# Altium project LC_MATCH_1.PrjPcb
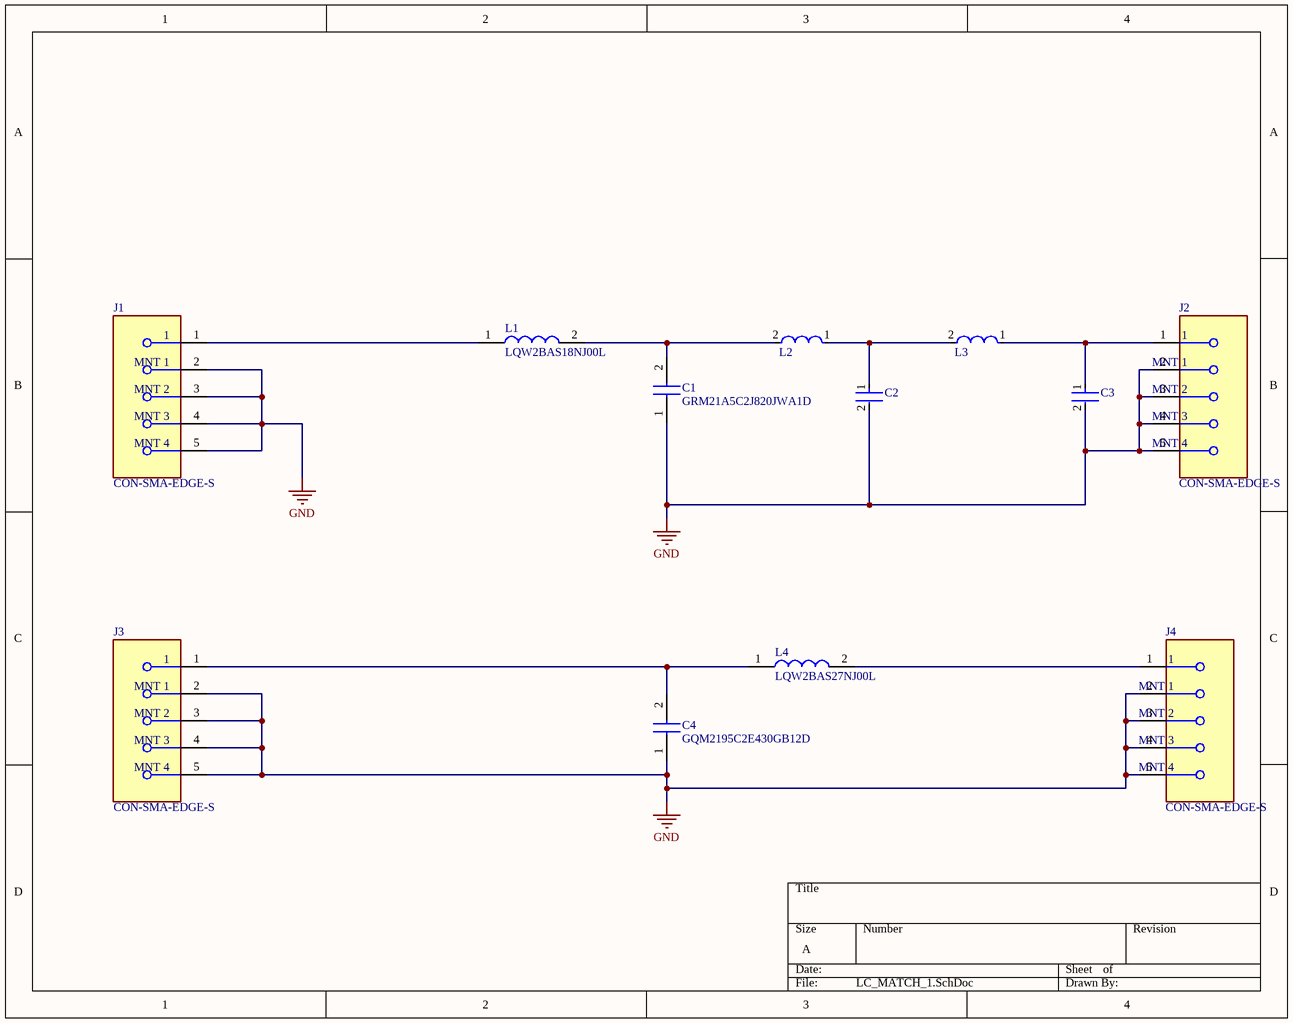
[diagram p0: LC_MATCH_1.SchDoc]
1 sheet, 12 parts. Net scope: global (net labels, ports and power ports of the same name join across sheets).
Board file: LC_MATCH_1.PcbDoc

## Sheet LC_MATCH_1.SchDoc
size A

### Parts
C1  GRM21A5C2J820JWA1D  [GRM21x]
C2  GQM2195C2E430GB12D  [FP-GRM21A-0_2-MFG]  (value not drawn)
C3  GQM2195C2E300GB12D  [FP-GRM21A-0_2-MFG]  (value not drawn)
C4  GQM2195C2E430GB12D  [GQM2195C2E100GB12D]
J1  CON-SMA-EDGE-S  [FP-CON-SMA-EDGE-S-MFG]
J2  CON-SMA-EDGE-S  [FP-CON-SMA-EDGE-S-MFG]
J3  CON-SMA-EDGE-S  [FP-CON-SMA-EDGE-S-MFG]
J4  CON-SMA-EDGE-S  [FP-CON-SMA-EDGE-S-MFG]
L1  LQW2BAS18NJ00L  [LQW2BAN11NG00L]
L2  LQW2BAS56NG00L  [FP-LQW2BAN_00-MFG]  (value not drawn)
L3  LQW2BAS56NG00L  [FP-LQW2BAN_00-MFG]  (value not drawn)
L4  LQW2BAS27NJ00L  [LQW2BAN11NG00L]

### Nets
GND: C1.1 C2.2 C3.2 C4.1 J1.2(MNT_1) J1.3(MNT_2) J1.4(MNT_3) J1.5(MNT_4) J2.2(MNT_1) J2.3(MNT_2) J2.4(MNT_3) J2.5(MNT_4) J3.2(MNT_1) J3.3(MNT_2) J3.4(MNT_3) J3.5(MNT_4) J4.2(MNT_1) J4.3(MNT_2) J4.4(MNT_3) J4.5(MNT_4)
NetC1_2: C1.2 L1.2 L2.2
NetC2_1: C2.1 L2.1 L3.2
NetC3_1: C3.1 J2.1 L3.1
NetC4_2: C4.2 J3.1 L4.1
NetJ1_1: J1.1 L1.1
NetJ4_1: J4.1 L4.2

### Library data of the parts
C1 = GRM21A5C2J820JWA1D: Capacitor; Manufacturer_Name: Murata Electronics; Datasheet Link: https://search.murata.co.jp/Ceramy/image/img/A01X/G101/ENG/GRM21A5C2J820JWA1-01.pdf; Height: 1.25mm; Manufacturer_Part_Number: GRM21A5C2J820JWA1D
C2 C3 = CMP-06035-012030-1: Chip Multilayer Ceramic Capacitors for General Purpose, 0805, 1000pF, C0G, 30ppm/°C, 1%, 250V
C4 = GQM2195C2E430GB12D: Capacitor; Manufacturer_Name: Murata Electronics; Datasheet Link: https://psearch.en.murata.com/capacitor/product/GQM2195C2E430GB12%23.html; Height: 1mm; Manufacturer_Part_Number: GQM2195C2E430GB12D
J1-J4 = CMP-204357-000001-1: CONN SMA JACK STR EDGE MNT; Manufacturer: RF Solutions Ltd.; Impedance: 50Ω; Conn Orientation: Right Angle; Is Female: yes; Number Of Contacts: 1; Frequency: 18GHz; Shielding: true; Category: Conn; ComponentLink2URL: https://www.rfsolutions.co.uk/downloads/1498648656DS-CON-EDGE-SMA-4.pdf; Octopart: https://octopart.com/con-sma-edge-s-rf+solutions-70967450; Package: CONN_JACK; Manufacturer Part Number: CON-SMA-EDGE-S; Height: 6.35mm; Device Class L1: Connectors; Footprint Url: https://forum.upverter.com/uploads/default/original/3X/b/e/be75b907af57498775929d6d9099689c472e0307.pdf; Contact Material: Gold; ComponentLink2Description: Datasheet; Device Class L2: RF / Coaxial Connectors; RoHS: TRUE; Device Class L3: unset; Digikey Description: CONN SMA JACK STR EDGE MNT; Lead Free: Yes; Automotive: No
L1 = LQW2BAS18NJ00L: Inductor; Manufacturer_Name: Murata Electronics; Datasheet Link: https://psearch.en.murata.com/inductor/product/LQW2BAS18NJ00%23.html; Height: 1.52mm; Manufacturer_Part_Number: LQW2BAS18NJ00L; Mouser Part Number: 81-LQW2BAS18NJ00L; Mouser Price/Stock: https://www.mouser.co.uk/ProductDetail/Murata-Electronics/LQW2BAS18NJ00L?qs=XY81OjNnpal2Dbjq17m9Aw%3D%3D; Arrow Part Number: LQW2BAS18NJ00L; Arrow Price/Stock: https://www.arrow.com/en/products/lqw2bas18nj00l/murata-manufacturing
L2 L3 = CMP-06042-001883-1: Wire Wound RF Inductor 56nH ±2% 500mA 0.34Ω 0805 (2015); Shielding: Unshielded; DC Resistance (DCR): 340mR; Test Frequency: 200MHz; Self Resonant Frequency: 1.6GHz; Width: 0.06inch; Min Operating Temperature: -40°C; Inductance: 56nH; Mount: Surface Mount; Packaging: Tape and Reel; Resistor Type: Wirewound; Max Operating Temperature: 85°C; Package Quantity: 2000; Current Rating: 500mA; Case/Package: 0805; Length: 0.082inch; Height - Seated (Max): 0.061inch; Tolerance: 2%
L4 = LQW2BAS27NJ00L: Inductor; Manufacturer_Name: Murata Electronics; Datasheet Link: https://psearch.en.murata.com/inductor/product/LQW2BAS27NJ00%23.html; Height: 1.52mm; Manufacturer_Part_Number: LQW2BAS27NJ00L; Mouser Part Number: 81-LQW2BAS27NJ00L; Mouser Price/Stock: https://www.mouser.com/Search/Refine.aspx?Keyword=81-LQW2BAS27NJ00L